# EasyEDA Pro project Blance_Car.epro

# Schematic 平衡小车
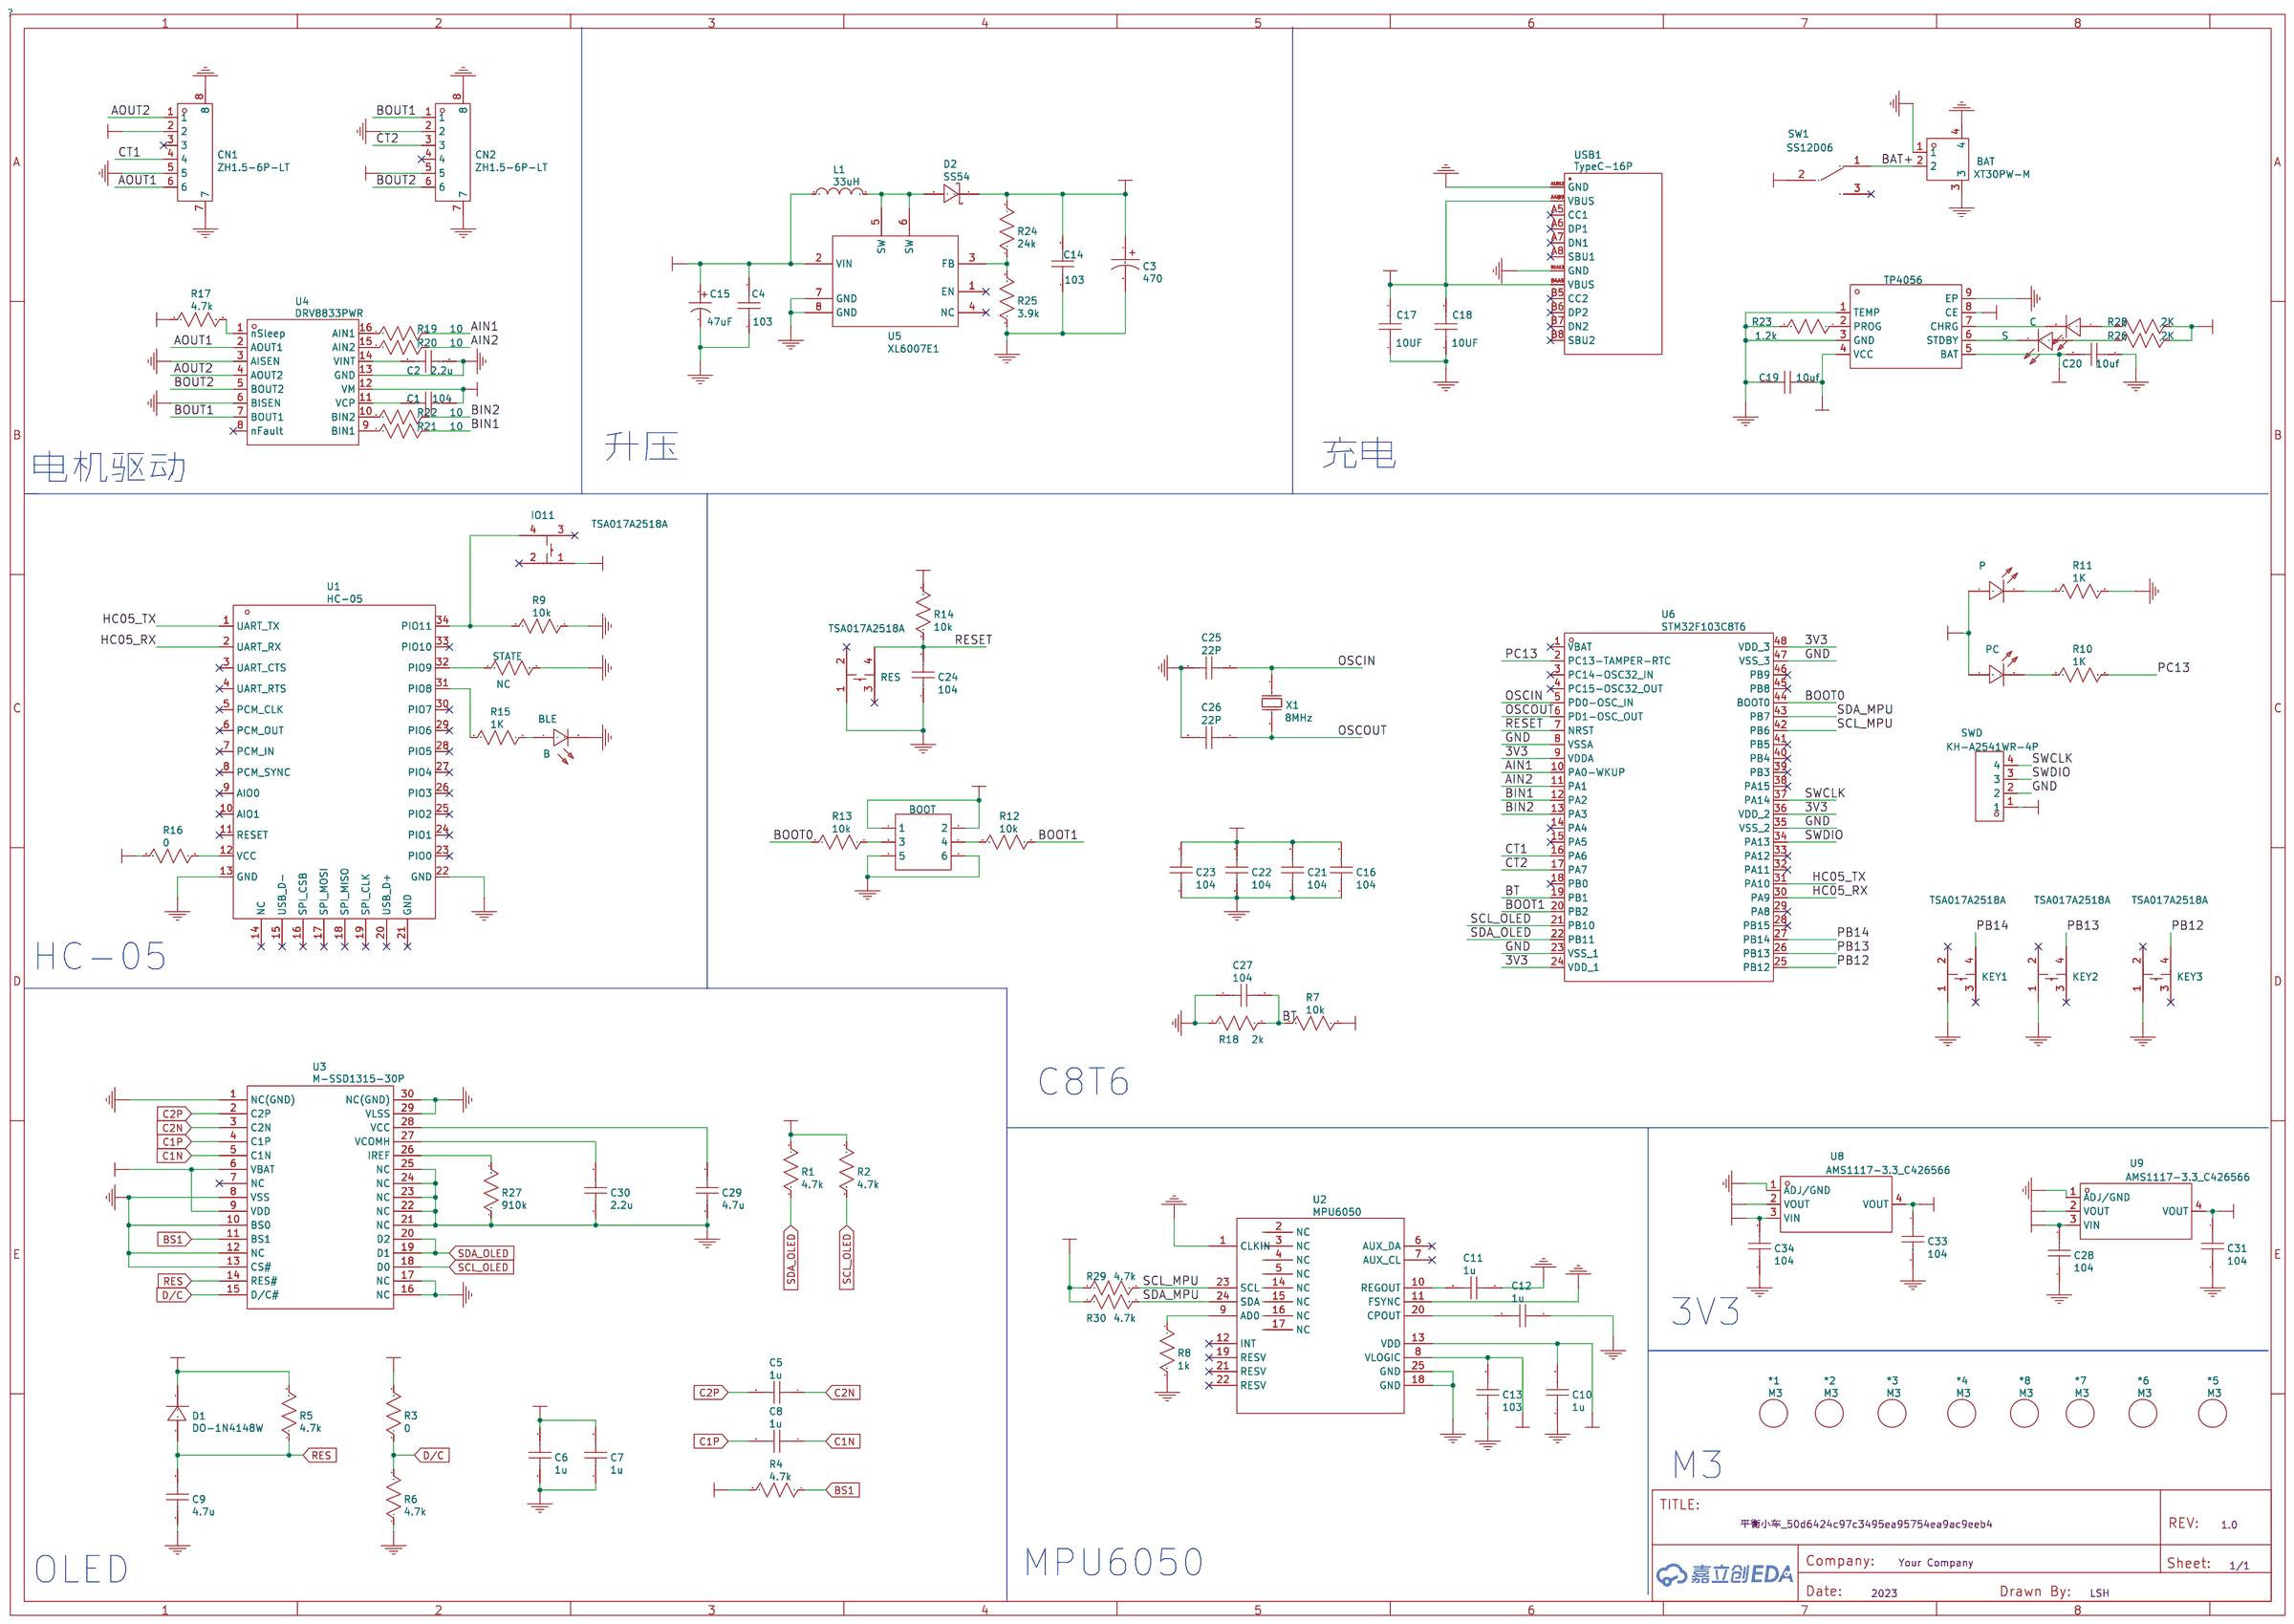
[diagram p0: schematic sheet]

## Parts
*1  M3  [M3 125X200]
*2  M3  [M3 125X200]
*3  M3  [M3 125X200]
*4  M3  [M3 125X200]
*5  M3  [M3 125X200]
*6  M3  [M3 125X200]
*7  M3  [M3 125X200]
*8  M3  [M3 125X200]
BAT  XT30PW-M  [CONN-TH_XT30PW-M]
BLE  B  [LED0603-R-RD]
BOOT  HDR-IDC-2.54-2X3P  [HDR-TH_6P-P2.54-V-M-R2-C3-S2.54-1]
C  204-10SURD/S530-A3  [LED0805-RD]
C1  104  [C0805]
C2  2.2u  [C0805]
C3  470  [CAP-SMD_BD6.3-L6.6-W6.6-FD]
C4  103  [C0805]
C5  1u  [C0603]
C6  1u  [C0603]
C7  1u  [C0603]
C8  1u  [C0603]
C9  4.7u  [C0603]
C10  1u  [C0603]
C11  1u  [C0603]
C12  1u  [C0603]
C13  103  [C0603]
C14  103  [C0805]
C15  47uF  [CAP-SMD_BD6.3-L6.6-W6.6-FD]
C16  104  [C0603]
C17  10UF  [C0805]
C18  10UF  [C0805]
C19  10uf  [C0603]
C20  10uf  [C0805]
C21  104  [C0603]
C22  104  [C0603]
C23  104  [C0603]
C24  104  [C0603]
C25  22P  [C0603]
C26  22P  [C0603]
C27  104  [C0603]
C28  104  [C0805]
C29  4.7u  [C0603]
C30  2.2u  [C0603]
C31  104  [C0805]
C33  104  [C0805]
C34  104  [C0805]
CN1  ZH1.5-6P-LT  [CONN-SMD_ZH1.5-6P-LT]
CN2  ZH1.5-6P-LT  [CONN-SMD_ZH1.5-6P-LT]
D1  DO-1N4148W  [SOD-123FL]
D2  SS54  [SMA_L4.4-W2.8-LS5.4-RD]
IO11  TSA017A2518A  [SW-SMD_4P-L4.2-W3.2-P2.15-LS5.2]
KEY1  TSA017A2518A  [SW-SMD_4P-L4.2-W3.2-P2.15-LS5.2]
KEY2  TSA017A2518A  [SW-SMD_4P-L4.2-W3.2-P2.15-LS5.2]
KEY3  TSA017A2518A  [SW-SMD_4P-L4.2-W3.2-P2.15-LS5.2]
L1  33uH  [IND-SMD_L12.5-W12.5_GSDRK127P]
P  204-10SURD/S530-A3  [LED0805-RD]
PC  204-10SURD/S530-A3  [LED0805-RD]
R1  4.7k  [R0603]
R2  4.7k  [R0603]
R3  0  [R0603]
R4  4.7k  [R0603]
R5  4.7k  [R0603]
R6  4.7k  [R0603]
R7  10k  [R0603]
R8  1k  [R0603]
R9  10k  [R0603]
R10  1K  [R0603]
R11  1K  [R0603]
R12  10k  [R0603]
R13  10k  [R0603]
R14  10k  [R0603]
R15  1K  [R0603]
R16  0  [R0603]
R17  4.7k  [R0603]
R18  2k  [R0603]
R19  10  [R0603]
R20  10  [R0603]
R21  10  [R0603]
R22  10  [R0603]
R23  1.2k  [R0603]
R24  24k  [R0603]
R25  3.9k  [R0603]
R26  2K  [R0603]
R27  910k  [R0603]
R28  2K  [R0603]
R29  4.7k  [R0603]
R30  4.7k  [R0603]
RES  TSA017A2518A  [SW-SMD_4P-L4.2-W3.2-P2.15-LS5.2]
S  204-10SURD/S530-A3  [LED0805-RD]
STATE  NC  [R0603]
SW1  SS12D06  [SW-TH_HOOYA_SS-12D06G4]
SWD  KH-A2541WR-4P  [HDR-TH_4P-P2.54-H-M-W10.4]
U1  HC-05  [BULETM-SMD_HC-05]
U2  MPU6050  [QFN-24_L4.0-W4.0-P0.50-TL-EP2.7]
U3  M-SSD1315-30P  [M-SSD1315-30PIN]
U4  DRV8833PWR  [TSSOP-16_L5.0-W4.4-P0.65-LS6.4-BL]
U5  XL6007E1  [SOIC-8_L5.0-W4.0-P1.27-LS6.0-BL]
U6  STM32F103C8T6  [LQFP-48_L7.0-W7.0-P0.50-LS9.0-BL]
U7  TP4056  [ESOP-8_L4.9-W3.9-P1.27-LS6.0-BL-EP]
U8  AMS1117-3.3_C426566  [SOT-223_L6.5-W3.5-P2.30-LS7.0-BR]
U9  AMS1117-3.3_C426566  [SOT-223_L6.5-W3.5-P2.30-LS7.0-BR]
USB1  TypeC-16P  [USB-SMD_TYPEC-16PIN]
X1  8MHz  [HC-49-SMD_L7.0-W3.0]

## Library data of the parts
*1-*8 = M3: BOM名称: 铜柱孔; 学习资源: www.ooocke.com; 版权归属: 源创客
BAT = XT30PW-M: link: https://cn.bing.com/search?q=datasheet: XT30PW-M; Supplier: LCSC; Supplier Part: C431092; Manufacturer: Changzhou Amass Elec; JLCPCB Part Class: Extended Part
BLE = B: link: https://lcsc.com/product-detail/Light-Emitting-Diodes-LED_Hubei-KENTO-Elec-0603-Green_C12624.html; Supplier: LCSC; Manufacturer: EVERLIGHT; Manufacturer Part: 19-217/BHC-ZL1M2RY/3T; image: //image.lceda.cn/szlcsc/C72041.jpg; Supplier Part: C72041; JLCPCB Part Class: Basic; JLCPCB SMD: Yes
BOOT = HDR-IDC-2.54-2X3P: link: https://lcsc.com/product-detail/Female-Header_Made-in-China-Made-in-China-Made-in-China-Made-in-Cina-2-54mm-2x3-Female-header-Bagged-RoHS_C47552.html; 3DModel: HDR2.54-M-LI-2x3P; Supplier: LCSC; Manufacturer: BOOMELE; Manufacturer Part: 2X3 2.54mm IDC Box; image: //image.lceda.cn/szlcsc/C11214.jpg; Supplier Part: C11214
C P PC S = 204-10SURD/S530-A3: link: https://item.szlcsc.com/255094.html; Supplier: LCSC; Manufacturer: EVERLIGHT; Supplier Part: C99772
C1 C28 C31 C33 C34 = 104: link: https://item.szlcsc.com/373011.html; 3DModel: C0805_L2.0-W1.3-H1.3
C2 = 2.2u: link: https://item.szlcsc.com/373011.html; 3DModel: C0805_L2.0-W1.3-H1.3
C3 = 470: link: https://item.szlcsc.com/265679.html
C4 C14 = 103: link: https://item.szlcsc.com/373011.html; 3DModel: C0805_L2.0-W1.3-H1.3
C5-C8 C10-C12 = 1u: link: https://item.szlcsc.com/362304.html; 3DModel: C0603_L1.6-W0.8-H0.8
C9 C29 = 4.7u: link: https://item.szlcsc.com/362304.html; 3DModel: C0603_L1.6-W0.8-H0.8
C13 = 103: link: https://item.szlcsc.com/362304.html; 3DModel: C0603_L1.6-W0.8-H0.8
C15 = 47uF: link: https://item.szlcsc.com/265679.html; Supplier: LCSC; Manufacturer: ROQANG; Manufacturer Part: RVT1V470M0605; Supplier Part: C72522; JLCPCB Part Class: Extended Part
C16 C21-C24 C27 = 104: link: https://item.szlcsc.com/362304.html; 3DModel: C0603_L1.6-W0.8-H0.8
C17 C18 = 10UF: link: https://item.szlcsc.com/373011.html; 3DModel: C0805_L2.0-W1.3-H1.3
C19 = 10uf: link: https://item.szlcsc.com/362304.html; 3DModel: C0603_L1.6-W0.8-H0.8
C20 = 10uf: link: https://item.szlcsc.com/373011.html; 3DModel: C0805_L2.0-W1.3-H1.3
C25 C26 = 22P: link: https://item.szlcsc.com/362304.html; 3DModel: C0603_L1.6-W0.8-H0.8
C30 = 2.2u: link: https://item.szlcsc.com/362304.html; 3DModel: C0603_L1.6-W0.8-H0.8
CN1 CN2 = ZH1.5-6P-LT: link: https://item.szlcsc.com/767135.html; Supplier: LCSC; Supplier Part: C722928; Manufacturer: CAX; JLCPCB Part Class: Extended Part
D1 = DO-1N4148W: 3DModel: SOD-123FL_L2.8-W1.8-H1.1-LS3.6; Manufacturer: MDD; Manufacturer Part: 1N4148W; Supplier: LCSC; Supplier Part: C84367; 单价: 0.044841; 物料编码: A20006
D2 = SS54: link: https://so.szlcsc.com/global.html?c=&k=C50840; Supplier: LCSC; Supplier Part: C116709; Manufacturer: Jingdao; Manufacturer Part: SS210; JLCPCB Part Class: Extended Part
IO11 KEY1-KEY3 RES = TSA017A2518A: link: https://item.szlcsc.com/617092.html; Supplier: LCSC; Supplier Part: C2888884; Manufacturer: BZCN(博众电气); JLCPCB Part Class: Extended Part
L1 = 33uH: link: https://item.szlcsc.com/153750.html; 3DModel: IND-SMD_L12.5-W12.5-H8.0_GSDRK127P; Supplier: LCSC; Supplier Part: C329385; Manufacturer: Chilisin Elec; Manufacturer Part: MHCI06030-330M-R8; JLCPCB Part Class: Extended Part
R1 R2 R4-R6 R29 R30 = 4.7k: 3DModel: R0603_L1.6-W0.8-H0.8; link: https://www.mouser.in/datasheet/2/447/PYu_RT_1_to_0_01_RoHS_L_11-1669912.pdf
R3 = 0: 3DModel: R0603_L1.6-W0.8-H0.8; link: https://www.mouser.in/datasheet/2/447/PYu_RT_1_to_0_01_RoHS_L_11-1669912.pdf
R7 = 10k: 3DModel: R0603_L1.6-W0.8-H0.8; link: https://www.mouser.in/datasheet/2/447/PYu_RT_1_to_0_01_RoHS_L_11-1669912.pdf
R8 = 1k: 3DModel: R0603_L1.6-W0.8-H0.8; link: https://www.mouser.in/datasheet/2/447/PYu_RT_1_to_0_01_RoHS_L_11-1669912.pdf
R9 R12-R14 = 10k: link: https://item.szlcsc.com/137208.html; 3DModel: R0603_L1.6-W0.8-H0.8
R10 R11 R15 = 1K: link: https://item.szlcsc.com/137208.html; 3DModel: R0603_L1.6-W0.8-H0.8
R16 = 0: link: https://item.szlcsc.com/137208.html; 3DModel: R0603_L1.6-W0.8-H0.8
R17 = 4.7k: link: https://item.szlcsc.com/137208.html; 3DModel: R0603_L1.6-W0.8-H0.8
R18 = 2k: 3DModel: R0603_L1.6-W0.8-H0.8; link: https://www.mouser.in/datasheet/2/447/PYu_RT_1_to_0_01_RoHS_L_11-1669912.pdf
R19-R22 = 10: link: https://item.szlcsc.com/137208.html; 3DModel: R0603_L1.6-W0.8-H0.8
R23 = 1.2k: 3DModel: R0603_L1.6-W0.8-H0.8; link: https://www.mouser.in/datasheet/2/447/PYu_RT_1_to_0_01_RoHS_L_11-1669912.pdf
R24 = 24k: 3DModel: R0603_L1.6-W0.8-H0.8; link: https://www.mouser.in/datasheet/2/447/PYu_RT_1_to_0_01_RoHS_L_11-1669912.pdf
R25 = 3.9k: 3DModel: R0603_L1.6-W0.8-H0.8; link: https://www.mouser.in/datasheet/2/447/PYu_RT_1_to_0_01_RoHS_L_11-1669912.pdf
R26 R28 = 2K: 3DModel: R0603_L1.6-W0.8-H0.8; link: https://www.mouser.in/datasheet/2/447/PYu_RT_1_to_0_01_RoHS_L_11-1669912.pdf
R27 = 910k: 3DModel: R0603_L1.6-W0.8-H0.8; link: https://www.mouser.in/datasheet/2/447/PYu_RT_1_to_0_01_RoHS_L_11-1669912.pdf
STATE = NC: link: https://item.szlcsc.com/137208.html; 3DModel: R0603_L1.6-W0.8-H0.8
SW1 = SS12D06: link: https://atta.szlcsc.com/upload/public/pdf/source/20220518/C4D36190FA72FACD82E80E12C2EEB692.pdf
SWD = KH-A2541WR-4P: link: https://item.szlcsc.com/502968.html; 3DModel: HDR-TH_4P-P2.54-M-WI-1X4P; Supplier: LCSC; Supplier Part: C2833320; Manufacturer: kinghelm(金航标); JLCPCB Part Class: Extended Part
U1 = HC-05
U2 = MPU6050: link: https://item.szlcsc.com/245167.html; 3DModel: QFN-24_L4.0-W4.0-H0.9-P0.50-; Manufacturer Part: ?
U3 = M-SSD1315-30P: 3DModel: OLED-0.96-SSD1306; Manufacturer: 中景园; Manufacturer Part: 0.96‘OLED-SS1315; Supplier: 淘宝; 单价: 8.5; 物料编码: A90004
U4 = DRV8833PWR: 3DModel: TSSOP-16_L5.0-W4.4-H1.0-LS6.4-P0.65; Supplier: LCSC; Supplier Part: C544801; Manufacturer: TI(德州仪器)
U5 = XL6007E1: link: https://item.szlcsc.com/417287.html; 3DModel: SOIC-8_L4.9-W3.9-H1.7-LS6.0-P1.27; Supplier: LCSC; Manufacturer: XLSEMI; Supplier Part: C73334; JLCPCB Part Class: Extended Part
U6 = STM32F103C8T6: link: https://atta.szlcsc.com/upload/public/pdf/source/20190808/C411336_D1D2DF7683029D856BA010BA7A5BF7EA.pdf; Supplier Part: C8734; Supplier: LCSC; 3DModel: LQFP-48_L7.0-W7.0-H1.4-LS9.0-P0.50; Manufacturer: STMicroelectronics; image: //image.lceda.cn/szlcsc/C8734.jpg; JLCPCB Part Class: Basic
U7 = TP4056: link: https://www.mornsun.cn/html/pdf/SCM1501B.html; 3DModel: ESOP-8_L4.9-W3.9-H1.6-LS6.0-P1.27; Supplier: LCSC; Supplier Part: C725790; Manufacturer: UMW(Youtai Semiconductor Co., Ltd.); JLCPCB Part Class: Extended Part
U8 U9 = AMS1117-3.3_C426566: link: https://item.szlcsc.com/109711.html; 3DModel: SOT-223-4P_L6.5-W3.5-H1.6-LS7.0-P2.30; Supplier: LCSC; Supplier Part: C426566; Manufacturer: SLKORMICRO Elec.; Manufacturer Part: AMS1117-3.3; JLCPCB Part Class: Extended Part
USB1 = TypeC-16P
X1 = 8MHz: link: https://item.szlcsc.com/404923.html; 3DModel: HC-49-SMD_L7.0-W4.0-H2.3-LS7.8; Supplier: LCSC; Manufacturer: YXC; Manufacturer Part: X49SD304MSD2SC; Supplier Part: C52061

## Nets
3V3: BOOT.1 BOOT.2 C6.2 C7.2 C10.2 C13.2 C16.2 C21.2 C22.2 C23.2 C31.1 C33.1 CN1.2 CN2.5 D1.2(K) IO11.1 P.1(A) PC.1(A) R1.1 R2.1 R3.2 R4.2 R5.2 R14.2 R16.2 R17.2 R29.1 R30.1 SWD.1 U2.8(VLOGIC) U2.13(VDD) U3.6(VBAT) U3.9(VDD) U6.9(VDDA) U6.24(VDD_1) U6.36(VDD_2) U6.48(VDD_3) U8.2(VOUT) U8.4(VOUT) U9.2(VOUT) U9.4(VOUT)
9V: C1.2 C3.1 C14.2 D2.1(K) R24.2 U4.12(VM)
GND: BAT.1 BAT.3 BAT.4 BLE.2(C) BOOT.5 BOOT.6 C2.2 C3.2 C4.1 C6.1 C7.1 C9.1 C10.1 C11.1 C12.1 C13.1 C14.1 C15.2 C16.1 C17.1 C18.1 C19.1 C20.2 C21.1 C22.1 C23.1 C24.1 C25.2 C26.2 C27.1 C28.1 C29.1 C30.1 C31.2 C33.2 C34.1 CN1.5 CN1.7 CN1.8 CN2.2 CN2.7 CN2.8 KEY1.1 KEY2.1 KEY3.1 R6.1 R8.2 R9.1 R11.2 R18.1 R23.2 R25.1 R27.1 RES.1 STATE.1 SWD.2 U1.13(GND) U1.22(GND) U2.1(CLKIN) U2.11(FSYNC) U2.18(GND) U2.25(GND) U3.1(NC(GND)) U3.8(VSS) U3.10(BS0) U3.12(NC) U3.13(CS#) U3.16(NC) U3.17(NC) U3.21(NC) U3.22(NC) U3.23(NC) U3.24(NC) U3.25(NC) U3.29(VLSS) U3.30(NC(GND)) U4.3(AISEN) U4.6(BISEN) U4.13(GND) U5.7(GND) U5.8(GND) U6.8(VSSA) U6.23(VSS_1) U6.35(VSS_2) U6.47(VSS_3) U7.1(TEMP) U7.3(GND) U7.9(EP) U8.1(ADJ/GND) U9.1(ADJ/GND) USB1.A1B12(GND) USB1.B1A12(GND)
AIN1: R19.1 U6.10(PA0-WKUP)
AIN2: R20.1 U6.11(PA1)
AOUT1: CN1.6 U4.2(AOUT1)
AOUT2: CN1.1 U4.4(AOUT2)
BAT+: BAT.2 C20.1 SW1.1 U7.5(BAT)
BIN1: R21.1 U6.12(PA2)
BIN2: R22.1 U6.13(PA3)
BOOT0: R13.2 U6.44(BOOT0)
BOOT1: R12.1 U6.20(PB2)
BOUT1: CN2.1 U4.7(BOUT1)
BOUT2: CN2.6 U4.5(BOUT2)
BS1: R4.1 U3.11(BS1)
BT: C27.2 R7.1 R18.2 U6.19(PB1)
C1N: C8.1 U3.5(C1N)
C1P: C8.2 U3.4(C1P)
C2N: C5.1 U3.3(C2N)
C2P: C5.2 U3.2(C2P)
CT1: CN1.4 U6.16(PA6)
CT2: CN2.3 U6.17(PA7)
D/C: R3.1 R6.2 U3.15(D/C#)
HC05_RX: U1.2(UART_RX) U6.30(PA9)
HC05_TX: U1.1(UART_TX) U6.31(PA10)
IN+: C17.2 C18.2 C19.2 R26.1 R28.1 U7.4(VCC) U7.8(CE) USB1.A4B9(VBUS) USB1.B4A9(VBUS)
NC: U2.2(NC) U2.3(NC) U2.4(NC) U2.5(NC) U2.14(NC) U2.15(NC) U2.16(NC) U2.17(NC)
OSCIN: C25.1 U6.5(PD0-OSC_IN) X1.1(OSC1)
OSCOUT: C26.1 U6.6(PD1-OSC_OUT) X1.2(OSC2)
PB12: KEY3.4 U6.25(PB12)
PB13: KEY2.4 U6.26(PB13)
PB14: KEY1.4 U6.27(PB14)
PC13: R10.2 U6.2(PC13-TAMPER-RTC)
POWER: C4.2 C15.1 C28.2 C34.2 L1.1 R7.2 SW1.2 U5.2(VIN) U8.3(VIN) U9.3(VIN)
RES: C9.2 D1.1(A) R5.1 U3.14(RES#)
RESET: C24.2 R14.1 RES.4 U6.7(NRST)
SCL_MPU: R29.2 U2.23(SCL) U6.42(PB6)
SCL_OLED: R2.2 U3.18(D0) U6.21(PB10)
SDA_MPU: R30.2 U2.24(SDA) U6.43(PB7)
SDA_OLED: R1.2 U3.19(D1) U3.20(D2) U6.22(PB11)
SWCLK: SWD.4 U6.37(PA14)
SWDIO: SWD.3 U6.34(PA13)
BLE_1: BLE.1(A) R15.1
R10_1: PC.2(K) R10.1
R11_1: P.2(K) R11.1
R12_2: BOOT.4 R12.2
R13_1: BOOT.3 R13.1
R23_1: R23.1 U7.2(PROG)
R26_2: R26.2 S.1(A)
R28_2: C.1(A) R28.2
U1_12: R16.1 U1.12(VCC)
U1_31: R15.2 U1.31(PIO8)
U1_32: STATE.2 U1.32(PIO9)
U1_34: IO11.4 R9.2 U1.34(PIO11)
U2_9: R8.1 U2.9(AD0)
U2_10: C11.2 U2.10(REGOUT)
U2_20: C12.2 U2.20(CPOUT)
U3_26: R27.2 U3.26(IREF)
U3_27: C30.2 U3.27(VCOMH)
U3_28: C29.2 U3.28(VCC)
U4_1: R17.1 U4.1(nSleep)
U4_9: R21.2 U4.9(BIN1)
U4_10: R22.2 U4.10(BIN2)
U4_11: C1.1 U4.11(VCP)
U4_14: C2.1 U4.14(VINT)
U4_15: R20.2 U4.15(AIN2)
U4_16: R19.2 U4.16(AIN1)
U5_3: R24.1 R25.2 U5.3(FB)
U5_5: D2.2(A) L1.2 U5.5(SW) U5.6(SW)
U7_6: S.2(K) U7.6(STDBY)
U7_7: C.2(K) U7.7(CHRG)

Not connected (* = marked no-connect by the designer): CN1 3*; CN2 4*; IO11 2* 3*; KEY1 2* 3*; KEY2 2* 3*; KEY3 2* 3*; RES 2* 3*; SW1 3*; U1 3(UART_CTS)* 4(UART_RTS)* 5(PCM_CLK)* 6(PCM_OUT)* 7(PCM_IN)* 8(PCM_SYNC)* 9(AIO0)* 10(AIO1)* 11(RESET)* 14(NC)* 15(USB_D-)* 16(SPI_CSB)* 17(SPI_MOSI)* 18(SPI_MISO)* 19(SPI_CLK)* 20(USB_D+)* 21(GND)* 23(PIO0)* 24(PIO1)* 25(PIO2)* 26(PIO3)* 27(PIO4)* 28(PIO5)* 29(PIO6)* 30(PIO7)* 33(PIO10)*; U2 6(AUX_DA)* 7(AUX_CL)* 12(INT)* 19(RESV)* 21(RESV)* 22(RESV)*; U3 7(NC)*; U4 8(nFault)*; U5 1(EN)* 4(NC)*; U6 1(VBAT)* 3(PC14-OSC32_IN)* 4(PC15-OSC32_OUT)* 14(PA4)* 15(PA5)* 18(PB0)* 28(PB15)* 29(PA8)* 32(PA11)* 33(PA12)* 38(PA15)* 39(PB3)* 40(PB4)* 41(PB5)* 45(PB8)* 46(PB9)*; USB1 A5(CC1)* A6(DP1)* A7(DN1)* A8(SBU1)* B5(CC2)* B6(DP2)* B7(DN2)* B8(SBU2)*

## Notes on the sheet
- 升压
- 充电
- 电机驱动
- HC-05
- C8T6
- 3V3
- M3
- MPU6050
- OLED

# Board 1-PCB_平衡小车
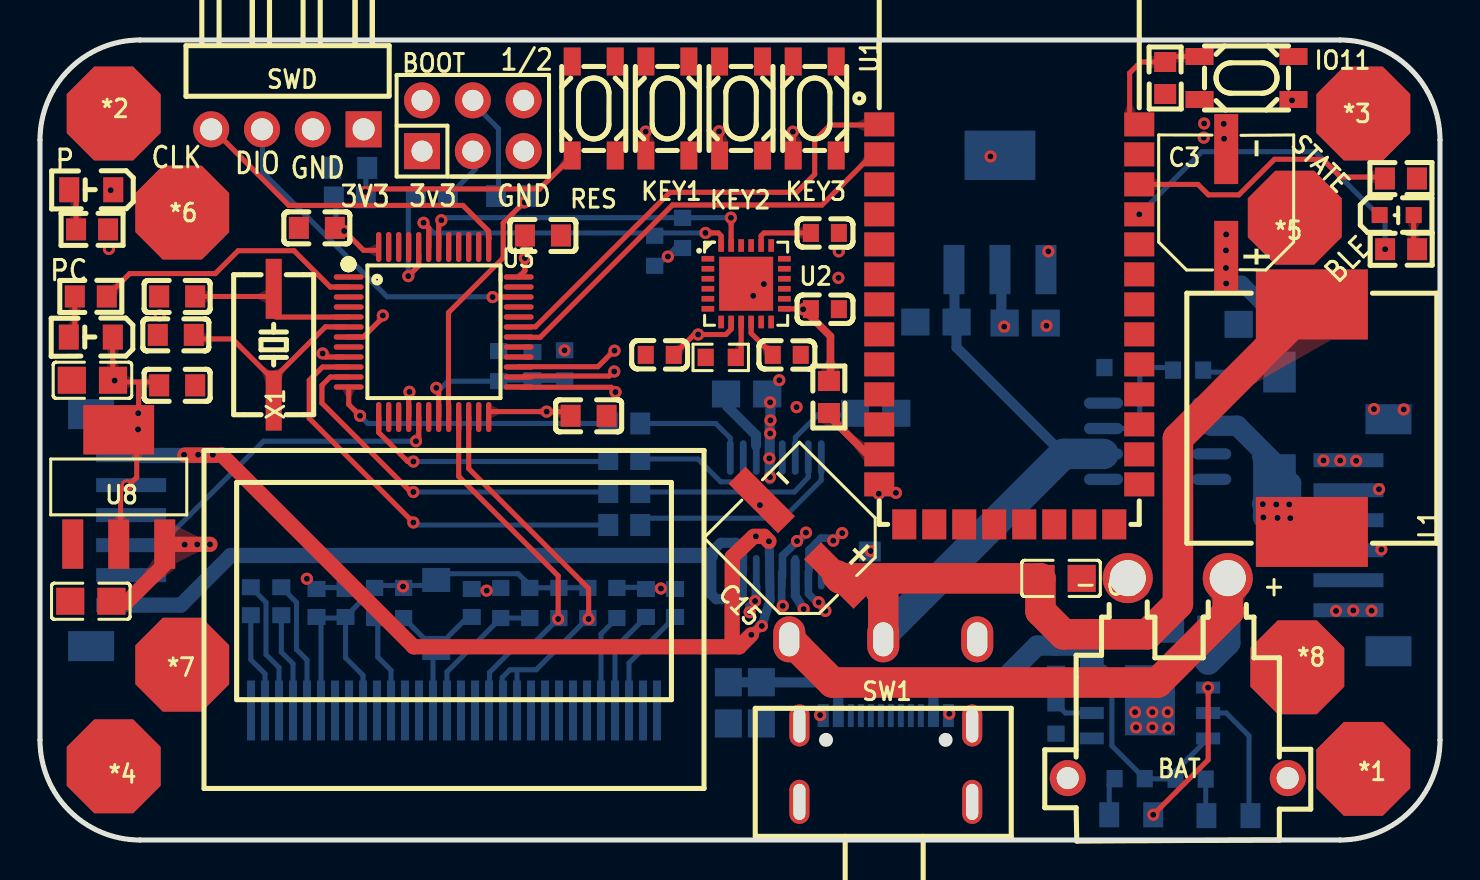
[diagram p1: board, top side]
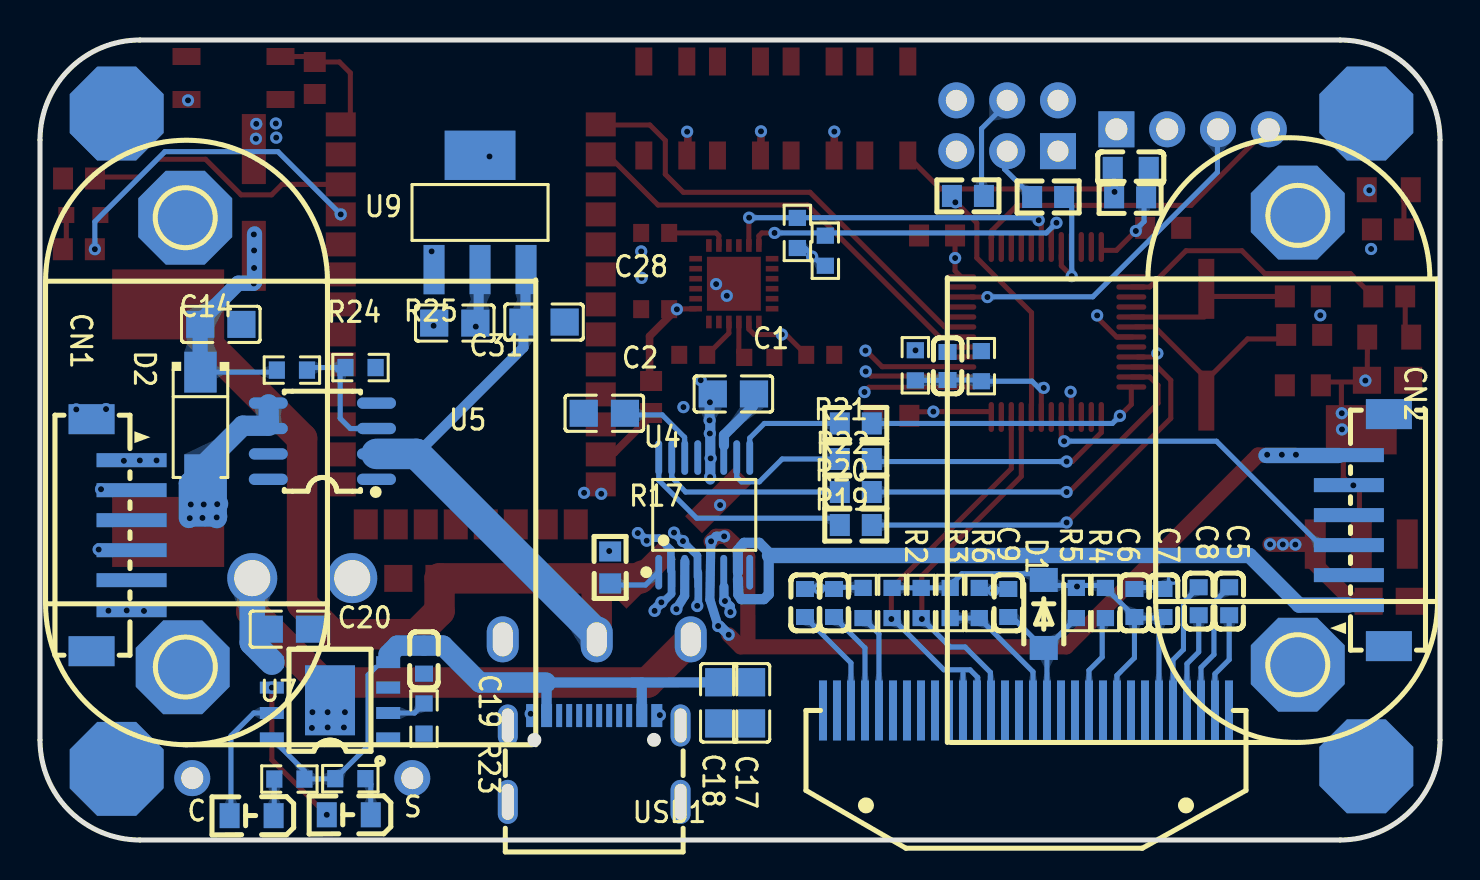
[diagram p2: board, bottom side, seen from below]

Outline 70 x 40 mm; copper layers: Top Layer, Inner1, Inner2, Bottom Layer. Coordinates in mm from the lower left corner of the outline.
Outline path: 0,35 arc(1.46,38.54) 5,40 65,40 arc(68.54,38.54) 70,35 70,5 arc(68.54,1.46) 65,0 5,0 arc(1.46,1.46) 0,5 0,35
Stack: Top Layer 0.035mm / Dielectric1 0.48mm PP er 4.5 / Inner1 0.035mm / Dielectric2 0.48mm FR4 er 4.5 / Inner2 0.035mm / Dielectric3 0.48mm PP er 4.5 / Bottom Layer 0.035mm

## Design rules (mm)
spacing Default (default): track to track 0.152, other pairs 0 to 0.152
track width Default (default): min 0.254, default 0.254, max 25.4
differential pair differentialPair (default): width min 0.127, default 0.254, max 2.54; gap min 0.152, default 0.152
via Default (default): diameter min 0.61, default 0.61, max 100.025; hole min 0.305, default 0.305, max 59.995
net GND uses gge67329
net 3V3 uses gge67296
pour e29 uses gge67302
pour e62 uses gge67296
pour e364 uses gge67308
pour e766 uses gge67329

## Placement (name value [footprint] x y rotation side)
*1  M3  [M3 125X200]  66.17 3.56 0 top
*2  M3  [M3 125X200]  3.68 36.32 0 top
*3  M3  [M3 125X200]  66.17 36.32 0 top
*4  M3  [M3 125X200]  3.68 3.68 0 top
*5  M3  [M3 125X200]  62.74 31.11 0 top
*6  M3  [M3 125X200]  7.11 31.37 0 top
*7  M3  [M3 125X200]  7.11 8.76 0 top
*8  M3  [M3 125X200]  62.87 8.64 0 top
BAT  XT30PW-M  [CONN-TH_XT30PW-M]  56.89 8.09 0 top
BLE  B  [LED0603-R-RD]  67.83 31.25 0 top
BOOT  HDR-IDC-2.54-2X3P  [HDR-TH_6P-P2.54-V-M-R2-C3-S2.54-1]  21.64 35.71 0 top
C  204-10SURD/S530-A3  [LED0805-RD]  59.42 1.22 0 bottom
C1  104  [C0805]  35.33 22.3 0 bottom
C2  2.2u  [C0805]  41.78 21.34 0 bottom
C3  470  [CAP-SMD_BD6.3-L6.6-W6.6-FD]  59.31 31.88 90 top
C4  103  [C0805]  51.05 13.08 180 top
C5  1u  [C0603#2]  10.54 11.94 270 bottom
C6  1u  [C0603#2]  15.28 11.85 270 bottom
C7  1u  [C0603#2]  13.83 11.85 270 bottom
C8  1u  [C0603#2]  12.06 11.94 270 bottom
C9  4.7u  [C0603#2]  21.59 11.85 270 bottom
C10  1u  [C0603#2]  39.24 26.54 180 top
C11  1u  [C0603#2]  37.34 24.26 180 top
C12  1u  [C0603#2]  39.24 30.35 180 top
C13  103  [C0603#2]  30.99 24.26 0 top
C14  103  [C0805]  60.96 25.78 0 bottom
C15  47uF  [CAP-SMD_BD6.3-L6.6-W6.6-FD]  37.97 15.11 135 top
C16  104  [C0603]  27.43 21.21 180 top
C17  10UF  [C0805]  34.42 6.86 90 bottom
C18  10UF  [C0805]  36.07 6.86 90 bottom
C19  10uf  [C0603#2]  50.8 9.02 90 bottom
C20  10uf  [C0805]  57.53 10.54 180 bottom
C21  104  [C0603]  13.84 30.61 0 top
C22  104  [C0603]  25.15 30.23 180 top
C23  104  [C0603]  6.86 22.73 180 top
C24  104  [C0603]  15.46 33.61 0 bottom
C25  22P  [C0603]  6.86 27.18 180 top
C26  22P  [C0603]  6.79 25.26 180 top
C27  104  [C0603#2]  24.62 23.7 270 bottom
C28  104  [C0805]  44.8 25.9 0 bottom
C29  4.7u  [C0603#2]  31.75 11.85 270 bottom
C30  2.2u  [C0603#2]  30.3 11.85 270 bottom
C31  104  [C0805]  49.26 25.85 0 bottom
C33  104  [C0805]  2.62 22.99 180 top
C34  104  [C0805]  2.54 11.94 0 top
CN1  ZH1.5-6P-LT  [CONN-SMD_ZH1.5-6P-LT]  66.42 15.24 270 bottom
CN2  ZH1.5-6P-LT  [CONN-SMD_ZH1.5-6P-LT]  3.56 15.49 90 bottom
D1  DO-1N4148W  [SOD-123FL]  19.81 11.3 270 bottom
D2  SS54  [SMA_L4.4-W2.8-LS5.4-RD]  61.98 20.83 270 bottom
IO11  TSA017A2518A  [SW-SMD_4P-L4.2-W3.2-P2.15-LS5.2]  60.32 38.1 270 top
KEY1  TSA017A2518A  [SW-SMD_4P-L4.2-W3.2-P2.15-LS5.2]  31.37 36.58 0 top
KEY2  TSA017A2518A  [SW-SMD_4P-L4.2-W3.2-P2.15-LS5.2]  35.05 36.58 0 top
KEY3  TSA017A2518A  [SW-SMD_4P-L4.2-W3.2-P2.15-LS5.2]  38.74 36.58 0 top
L1  33uH  [IND-SMD_L12.5-W12.5_GSDRK127P]  63.59 21.09 270 top
P  204-10SURD/S530-A3  [LED0805-RD]  2.56 32.51 180 top
PC  204-10SURD/S530-A3  [LED0805-RD]  2.54 25.15 180 top
R1  4.7k  [R0603#2]  27.39 11.85 270 bottom
R2  4.7k  [R0603#2]  25.94 11.85 270 bottom
R3  0  [R0603#2]  24.49 11.85 90 bottom
R4  4.7k  [R0603#2]  16.73 11.85 90 bottom
R5  4.7k  [R0603#2]  18.18 11.85 90 bottom
R6  4.7k  [R0603#2]  23.04 11.85 270 bottom
R7  10k  [R0603#2]  26.23 23.73 90 bottom
R8  1k  [R0603#2]  34.04 24.13 180 top
R9  10k  [R0603]  56.26 38.1 90 top
R10  1K  [R0603]  2.54 27.18 0 top
R11  1K  [R0603]  2.6 30.53 0 top
R12  10k  [R0603]  23.6 32.2 180 bottom
R13  10k  [R0603]  19.59 32.15 180 bottom
R14  10k  [R0603]  15.49 32.13 180 bottom
R15  1K  [R0603]  68.06 29.54 180 top
R16  0  [R0603]  39.45 22.15 90 top
R17  4.7k  [R0603]  41.49 13.63 90 bottom
R18  2k  [R0603#2]  22.94 23.69 270 bottom
R19  10  [R0603]  29.21 15.75 0 bottom
R20  10  [R0603]  29.21 17.4 0 bottom
R21  10  [R0603]  29.21 20.83 0 bottom
R22  10  [R0603]  29.21 19.05 0 bottom
R23  1.2k  [R0603#2]  50.8 6.07 270 bottom
R24  24k  [R0603#2]  57.4 23.5 0 bottom
R25  3.9k  [R0603#2]  53.97 23.62 0 bottom
R26  2K  [R0603#2]  54.48 3.07 180 bottom
R27  910k  [R0603#2]  28.85 11.85 270 bottom
R28  2K  [R0603#2]  57.53 3.05 0 bottom
R29  4.7k  [R0603#2]  32.13 30.35 90 bottom
R30  4.7k  [R0603#2]  30.73 29.46 90 bottom
RES  TSA017A2518A  [SW-SMD_4P-L4.2-W3.2-P2.15-LS5.2]  27.69 36.58 0 top
S  204-10SURD/S530-A3  [LED0805-RD]  54.56 1.26 0 bottom
STATE  NC  [R0603]  68.05 33.07 180 top
SW1  SS12D06  [SW-TH_HOOYA_SS-12D06G4]  42.16 10.03 0 top
SWD  KH-A2541WR-4P  [HDR-TH_4P-P2.54-H-M-W10.4]  12.37 35.53 180 top
U1  HC-05  [BULETM-SMD_HC-05]  48.46 25.78 0 top
U2  MPU6050  [QFN-24_L4.0-W4.0-P0.50-TL-EP2.7]  35.31 27.81 0 top
U3  M-SSD1315-30P  [M-SSD1315-30PIN]  20.7 6.48 0 top
U4  DRV8833PWR  [TSSOP-16_L5.0-W4.4-P0.65-LS6.4-BL]  36.79 16.26 180 bottom
U5  XL6007E1  [SOIC-8_L5.0-W4.0-P1.27-LS6.0-BL]  55.88 19.94 90 bottom
U6  STM32F103C8T6  [LQFP-48_L7.0-W7.0-P0.50-LS9.0-BL]  19.69 25.4 270 top
U7  TP4056  [ESOP-8_L4.9-W3.9-P1.27-LS6.0-BL-EP]  55.5 6.98 90 bottom
U8  AMS1117-3.3_C426566  [SOT-223_L6.5-W3.5-P2.30-LS7.0-BR]  3.94 17.65 270 top
U9  AMS1117-3.3_C426566  [SOT-223_L6.5-W3.5-P2.30-LS7.0-BR]  48 31.38 270 bottom
USB1  TypeC-16P  [USB-SMD_TYPEC-16PIN]  42.29 4.06 180 bottom
X1  8MHz  [HC-49-SMD_L7.0-W3.0]  11.68 24.77 270 top

## Footprints (pads in the part's own frame, mm; a bottom-side part is the same pattern mirrored in y, then rotated)
BULETM-SMD_HC-05
  rect 1.5x1.2 smd: 1(-6.5,10) 2(-6.5,8.5) 3(-6.5,7) 4(-6.5,5.5) 5(-6.5,4) 6(-6.5,2.5) 7(-6.5,1) 8(-6.5,-0.5) 9(-6.5,-2) 10(-6.5,-3.5) 11(-6.5,-5) 12(-6.5,-6.5) 13(-6.5,-8) 22(6.5,-8) 23(6.5,-6.5) 24(6.5,-5) 25(6.5,-3.5) 26(6.5,-2) 27(6.5,-0.5) 28(6.5,1) 29(6.5,2.5) 30(6.5,4) 31(6.5,5.5) 32(6.5,7) 33(6.5,8.5) 34(6.5,10)
  rect 1.2x1.5 smd: 14(-5.25,-10) 15(-3.75,-10) 16(-2.25,-10) 17(-0.75,-10) 18(0.75,-10) 19(2.25,-10) 20(3.75,-10) 21(5.25,-10)
C0603
  rect 1x1.1 smd: 1(-0.9,0) 2(0.9,0)
C0603#2
  rect 0.8x0.9 smd: 1(-0.7,0) 2(0.7,0)
C0805
  rect 1.41x1.35 smd: 1(-1.03,0) 2(1.03,0)
CAP-SMD_BD6.3-L6.6-W6.6-FD
  rect 3.5x1.2 smd: 1(-2.67,0) 2(2.67,0)
CONN-SMD_ZH1.5-6P-LT
  rect 0.7x3.5 smd: 1(-3.75,1) 2(-2.25,1) 3(-0.75,1) 4(0.75,1) 5(2.249,1) 6(3.75,1)
  rect 1.5x2.3 smd: 7(5.8,-1) 8(-5.8,-1)
CONN-TH_XT30PW-M
  round 2.5 hole 1.8: 1(-2.5,5) 2(2.5,5)
  round 1.8 hole 1.1: 3(5.5,-5) 4(-5.5,-5)
ESOP-8_L4.9-W3.9-P1.27-LS6.0-BL-EP
  rect 0.6x1.2 smd: 1(-1.905,-2.909) 2(-0.635,-2.909) 3(0.635,-2.909) 4(1.905,-2.909) 5(1.905,2.909) 6(0.635,2.909) 7(-0.635,2.909) 8(-1.905,2.909)
  rect 3.5x2.5 smd: 9(0,0)
HC-49-SMD_L7.0-W3.0
  rect 3x0.8 smd: 1(-2.794,0) 2(2.794,0)
HDR-TH_4P-P2.54-H-M-W10.4
  rect 1.8x1.8 hole 1.1: 1(-3.81,0)
  round 1.8 hole 1.1: 2(-1.27,0) 3(1.27,0) 4(3.81,0)
HDR-TH_6P-P2.54-V-M-R2-C3-S2.54-1
  rect 1.8x1.8 hole 1.05: 1(-2.54,-1.27)
  round 1.8 hole 1.05: 2(-2.54,1.27) 3(0,-1.27) 4(0,1.27) 5(2.54,-1.27) 6(2.54,1.27)
IND-SMD_L12.5-W12.5_GSDRK127P
  rect 3.5x5.6 smd: 1(-5.687,0) 2(5.688,0)
LED0603-R-RD
  rect 0.8x0.8 smd: 1(0.851,0) 2(-0.851,0)
LED0805-RD
  rect 1x1.25 smd: 1(-1.1,0) 2(1.1,0)
LQFP-48_L7.0-W7.0-P0.50-LS9.0-BL
  oval 0.27x1.5 smd: 1(-2.75,-4.25) 2(-2.25,-4.25) 3(-1.75,-4.25) 4(-1.25,-4.25) 5(-0.75,-4.25) 6(-0.25,-4.25) 7(0.25,-4.25) 8(0.75,-4.25) 9(1.25,-4.25) 10(1.75,-4.25) 11(2.25,-4.25) 12(2.75,-4.25) 25(2.75,4.25) 26(2.25,4.25) 27(1.75,4.25) 28(1.25,4.25) 29(0.75,4.25) 30(0.25,4.25) 31(-0.25,4.25) 32(-0.75,4.25) 33(-1.25,4.25) 34(-1.75,4.25) 35(-2.25,4.25) 36(-2.75,4.25)
  oval 1.5x0.27 smd: 13(4.25,-2.75) 14(4.25,-2.25) 15(4.25,-1.75) 16(4.25,-1.25) 17(4.25,-0.75) 18(4.25,-0.25) 19(4.25,0.25) 20(4.25,0.75) 21(4.25,1.25) 22(4.25,1.75) 23(4.25,2.25) 24(4.25,2.75) 37(-4.25,2.75) 38(-4.25,2.25) 39(-4.25,1.75) 40(-4.25,1.25) 41(-4.25,0.75) 42(-4.25,0.25) 43(-4.25,-0.25) 44(-4.25,-0.75) 45(-4.25,-1.25) 46(-4.25,-1.75) 47(-4.25,-2.25) 48(-4.25,-2.75)
M3 125X200
  custom 4.693x4.693 hole 3.18x3.175: 0(0,0)
M-SSD1315-30PIN
  rect 0.4x3 smd far side: 1(-10.15,0) 2(-9.45,0) 3(-8.751,0) 4(-8.05,0) 5(-7.351,0) 6(-6.651,0) 7(-5.95,0) 8(-5.25,0) 9(-4.55,0) 10(-3.85,0) 11(-3.15,0) 12(-2.45,0) 13(-1.75,0) 14(-1.05,0) 15(-0.35,0) 16(0.349,0) 17(1.05,0) 18(1.75,0) 19(2.45,0) 20(3.15,0) 21(3.85,0) 22(4.55,0) 23(5.25,0) 24(5.949,0) 25(6.649,0) 26(7.349,0) 27(8.05,0) 28(8.749,0) 29(9.45,0) 30(10.15,0)
QFN-24_L4.0-W4.0-P0.50-TL-EP2.7
  rect 0.633x0.28 smd: 1(-1.911,1.25) 2(-1.911,0.75) 3(-1.911,0.25) 4(-1.911,-0.25) 5(-1.911,-0.75) 6(-1.911,-1.25) 13(1.911,-1.25) 14(1.911,-0.75) 15(1.911,-0.25) 16(1.911,0.25) 17(1.911,0.75) 18(1.911,1.25)
  rect 0.28x0.633 smd: 7(-1.25,-1.911) 8(-0.75,-1.911) 9(-0.25,-1.911) 10(0.25,-1.911) 11(0.75,-1.911) 12(1.25,-1.911) 19(1.25,1.911) 20(0.75,1.911) 21(0.25,1.911) 22(-0.25,1.911) 23(-0.75,1.911) 24(-1.25,1.911)
  rect 2.7x2.7 smd: 25(0,0)
R0603
  rect 1x1.1 smd: 1(-0.8,0) 2(0.8,0)
R0603#2
  rect 0.806x0.864 smd: 1(-0.753,0) 2(0.753,0)
SMA_L4.4-W2.8-LS5.4-RD
  rect 2.046x1.62 smd: 1(-2.566,0) 2(2.566,0)
SOD-123FL
  rect 1.2x1.4 smd: 1(1.7,0) 2(-1.7,0)
SOIC-8_L5.0-W4.0-P1.27-LS6.0-BL
  oval 0.569x1.95 smd: 1(-1.905,-2.705) 2(-0.635,-2.705) 3(0.635,-2.705) 4(1.905,-2.705) 5(1.905,2.705) 6(0.635,2.705) 7(-0.635,2.705) 8(-1.905,2.705)
SOT-223_L6.5-W3.5-P2.30-LS7.0-BR
  rect 2.465x1.05 smd: 1(2.857,-2.3) 2(2.857,0) 3(2.857,2.3)
  rect 2.465x3.54 smd: 4(-2.857,0)
SW-SMD_4P-L4.2-W3.2-P2.15-LS5.2
  rect 0.85x1.4 smd: 1(1.075,2.35) 2(1.075,-2.35) 3(-1.075,2.35) 4(-1.075,-2.35)
SW-TH_HOOYA_SS-12D06G4
  oval 1.6x2.3 hole 1x1.7: 1(-4.7,0) 2(0,0) 3(4.7,0)
TSSOP-16_L5.0-W4.4-P0.65-LS6.4-BL
  oval 0.343x1.732 smd: 1(-2.275,-2.866) 2(-1.625,-2.866) 3(-0.975,-2.866) 4(-0.325,-2.866) 5(0.325,-2.866) 6(0.975,-2.866) 7(1.625,-2.866) 8(2.275,-2.866) 9(2.275,2.865) 10(1.625,2.865) 11(0.975,2.865) 12(0.325,2.865) 13(-0.325,2.865) 14(-0.975,2.865) 15(-1.625,2.865) 16(-2.275,2.865)
USB-SMD_TYPEC-16PIN
  oval 1x2.1 hole 0.6x1.7: 12(-4.32,1.663) 13(4.32,1.663)
  oval 1x2.2 hole 0.6x1.8: 14(-4.32,-2.158) 15(4.32,-2.158)
  rect 0.55x1.15 smd: A1B12(-3.13,2.158) A4B9(-2.38,2.158) B1A12(3.131,2.158) B4A9(2.38,2.158)
  rect 0.3x1.15 smd: A5(-1.25,2.158) A6(-0.25,2.158) A7(0.25,2.158) A8(1.25,2.158) B5(1.75,2.158) B6(0.75,2.158) B7(-0.75,2.158) B8(-1.75,2.158)

## Nets
As in the schematic.

Pads without a net: *1 0; *2 0; *3 0; *4 0; *5 0; *6 0; *7 0; *8 0; CN1 3; CN2 4; IO11 2 3; KEY1 2 3; KEY2 2 3; KEY3 2 3; RES 2 3; SW1 3; U1 3 4 5 6 7 8 9 10 11 14 15 16 17 18 19 20 21 23 24 25 26 27 28 29 30 33; U2 6 7 12 19 21 22; U3 7; U4 8; U5 1 4; U6 1 3 4 14 15 18 28 29 32 33 38 39 40 41 45 46; USB1 12 13 14 15 A5 A6 A7 A8 B5 B6 B7 B8

## Via types
v1: diameter 0.61, hole 0.305, Top Layer to Bottom Layer, 119 vias

## Routing (per net, layer and track width the routed paths; a pad name or vN(x,y) marks a point on that pad's centre or on a via; arc(x,y) is an arc through that point)
3V3: length 60.4
  Top Layer w0.254: 22.45,21.45 22.48,21.42 v1(25.33,21.42) ; 15.21,30.45 16.18,29.48 16.83,29.48 ; 4.89,21.47 4.93,21.5 4.93,22.83 ; U2.13 38.54,26.54 ; 4.03,14.94 4.03,17.53 4.33,17.84 ; 4.45,17.75 4.84,18.14 4.84,20.42 ; C13.2 32.71,25.27 34.29,25.27 34.56,25.54 34.56,25.9 ; 24.25,30.23 24.25,28.46 23.93,28.15 ; 5.89,22.72 5.71,22.9 3.75,22.9 ; 25.37,21.41 26.21,21.41 ; 3.62,25.22 3.64,22.94 ; 4.91,20.45 4.89,21.56 ; 15.13,24.15 14.27,24.15 14.13,24.29
  Top Layer w0.381: 39.52,23.14 39.52,25.19 38.23,26.48
  Bottom Layer w0.254: 14.05,6.48 14.05,10.92 13.83,11.15 ; 14.8,32.03 14.8,30.92 15.21,30.51 ; C6.2 15.28,9.11 16.15,8.23 U3.9 ; 19.68,13.08 19.91,13.31 23.9,13.31 24.28,12.93 24.32,12.93 ; 13.9,11.1 15.21,11.1 15.32,11.2 16.84,12.73 19.42,12.73 19.67,12.98 ; 32.16,29.57 31.72,29.57 30.81,28.65 ; 27.39,12.61 24.41,12.61
  Bottom Layer w0.508: 48.07,27.72 48.07,26.01 48.23,25.85
  vias: v1(3.53,32.49) v1(3.73,22.97) v1(4.33,17.73) v1(4.91,21.34) v1(4.9,20.53) v1(14.13,24.33) v1(15.21,30.45) v1(18.15,12.67) v1(24.25,29.1) v1(31.39,29.17) v1(32.91,25.28) v1(38.16,26.53) v1(41.54,14.45) v1(47.53,34.18) v1(48.21,25.67) v1(62.6,36.98) v1(66.95,17.54)
9V: length 47.9
  Inner1 w1.27: 59.22,27.84 59.32,27.94 59.32,30.34 ; v1(36.5,18.14) 36.5,22.17 42.03,27.7 59.36,27.7
  Bottom Layer w0.254: 58.16,23.5 58.26,23.39 D2.1
  Bottom Layer w0.508: 36.49,18.03 36.49,20.98 v1(36.52,20.98) 36.52,21.87 v1(36.5,21.88) 36.51,21.89 36.53,21.89
  Bottom Layer w0.762: 61.89,26.03 60.09,27.84 59.32,27.84 ; 59.32,27.84 59.27,27.89 59.27,30.3 ; 61.99,25.63 61.99,23.11 61.91,23.04
  vias: v1(36.51,20.33) v1(36.47,19.08) v1(36.96,22.99) v1(59.31,30.28) v1(59.3,29.48) v1(59.3,28.6) v1(59.31,27.83)
GND: length 10.4
  Bottom Layer w0.254: 13.83,12.57 13.83,12.64 13.36,13.11 ; 21.69,12.52 23.1,12.52 ; 15.21,12.62 13.92,12.62 13.86,12.57 ; 31.78,12.56 31.7,12.63 28.87,12.63
  Bottom Layer w0.457: 35.8,12.66 35.8,12 v1(35.75,11.95) 35.48,11.68 v1(35.48,11.39) ; 37.76,13.94 37.77,12.21 v1(38.18,11.54)
  vias: v1(3.45,29.55) v1(5.98,26.23) v1(13.34,13.06) v1(22.33,12.47) v1(31.04,12.57) v1(35.66,27.21) v1(36,16.75) v1(36.19,27.8) v1(37.83,21.64) v1(39.01,6.25) v1(39.94,29.43) v1(39.92,28.11) v1(41.94,17.31) v1(42.8,17.36) v1(45.47,6.31) v1(50.32,25.71) v1(50.42,29.43) v1(54.75,6.39) v1(54.8,5.63) v1(55.62,6.39) v1(55.62,5.63) v1(56.38,6.39) v1(56.41,5.6) v1(58.21,35.83) v1(58.19,35.12) v1(59.19,35.81) v1(59.21,35.06) v1(66.7,21.55) v1(68.19,21.53)
AIN1: length 21.3
  Top Layer w0.254: v1(18.67,15.88) 13.46,21.08 13.46,22.99 14.12,23.65 U6.10
  Bottom Layer w0.254: R19.1 18.8,15.75 v1(18.67,15.88)
AIN2: length 18.6
  Top Layer w0.254: v1(18.67,17.4) 18.54,17.4 14.1,21.84 14.1,22.73 14.51,23.15 U6.11
  Bottom Layer w0.254: R20.1 v1(18.67,17.4)
AOUT1: length 39
  Inner2 w1.016: v1(39.27,11.46) 39.27,14.19 40.57,15.48 46.03,15.48 50.41,11.1 60.44,11.1 61.48,12.14 64.63,12.14 65.25,11.51 66.68,11.51
  Bottom Layer w0.381: 40.06,15.37 39.78,15.09 39.04,15.09 38.46,14.51 38.46,13.47 ; 38.42,13.41 38.42,12.31 39.27,11.46
  Bottom Layer w0.457: v1(39.27,11.46) 39.27,11.55 v1(38.93,11.89)
  vias: v1(39.66,14.97) v1(40.11,15.35) v1(64.8,11.45) v1(65.66,11.48) v1(66.58,11.46)
AOUT2: length 38.4
  Inner2 w0.762: 38.32,15.47 37.14,14.28 v1(37.14,11.71)
  Inner2 w1.016: v1(37.85,14.95) 41.9,18.99 65.79,18.99
  Bottom Layer w0.381: 38.29,15.32 37.13,14.22 37.13,13.16 ; 37.15,11.58 37.15,11.7 v1(37.14,11.71) 37.08,11.76 37.08,13.38
  vias: v1(38.3,15.37) v1(64.17,18.98) v1(65.01,18.98) v1(65.81,18.96)
BAT+: length 30.6
  Top Layer w1.524: BAT.2 59.39,11.48 59.44,11.43 55.88,7.87 39.62,7.87 SW1.1
  Bottom Layer w1.27: U7.5 59.39,9.87 BAT.2
BIN1: length 14.2
  Top Layer w0.254: v1(16,21.21) 15.44,21.78 15.44,22.65
  Bottom Layer w0.254: R21.1 16.38,20.83 v1(16,21.21)
BIN2: length 12.9
  Top Layer w0.254: v1(18.67,18.92) 18.39,18.92 16.93,20.38 16.93,21.15
  Bottom Layer w0.254: v1(18.67,18.92) 28.28,18.92 R22.1
BLE_1: length 1.8
  Top Layer w0.254: BLE.1 68.68,29.71 68.86,29.54
BOOT0: length 5.3
  Top Layer w0.254: v1(18.41,28.19) 18.94,28.71 18.94,29.25
  Bottom Layer w0.254: v1(18.41,28.19) 18.41,31.71 18.81,32.1
BOOT1: length 11.8
  Top Layer w0.254: 24.23,31.92 23.16,30.85 23.16,29.11 20.42,26.37 20.42,21.71
  vias: v1(24.23,31.88)
BOUT1: length 37.6
  Bottom Layer w0.508: 35.1,13.38 35.11,14.5 34.8,14.86 34.04,14.86 33.53,14.35 33.53,14.22 ; 35.1,13.05 35.08,12.26 34.94,12.04 33.81,12.04 33.56,12.28 33.56,14.16
  Bottom Layer w0.762: CN2.1 7.05,11.75 9.53,14.22 33.53,14.22
BOUT2: length 49.2
  Top Layer w0.381: v1(36.09,10.7) 36,10.7 v1(35.57,10.26)
  Top Layer w0.762: v1(36.45,14.93) 36.2,15.18 v1(35.79,15.18) ; 7.24,19.25 9.1,19.25 18.68,9.66 34.96,9.66 v1(35.57,10.26) ; 34.61,9.9 34.62,14.16 35.69,15.18
  Bottom Layer w0.457: 36.09,10.7 36.51,12.02 36.46,14.92 36.2,15.18 35.79,15.18
  Bottom Layer w0.508: v1(35.57,10.26) 36,10.7 v1(36.09,10.7)
  Bottom Layer w0.762: 5.06,19.23 8.7,19.23
  vias: v1(7.2,19.26) v1(7.91,19.26) v1(8.64,19.26)
BS1: length 5
  Bottom Layer w0.254: 16.73,11.1 16.89,10.93 16.89,9.14 17.55,8.48 17.55,6.48
BT: length 8.5
  Top Layer w0.254: 19.93,21.15 19.93,22.36 19.81,22.48 v1(19.81,22.61)
  Bottom Layer w0.254: v1(19.81,22.61) 19.94,22.73 19.94,22.48 20.4,22.94 22.94,22.94 23,23 24.62,23 24.64,22.98 R7.1
C1N: length 6.7
  Bottom Layer w0.254: 12.06,12.64 12.83,11.88 12.83,9.53 13.35,9 U3.5
C1P: length 5
  Bottom Layer w0.254: 12.06,11.24 12.06,9.4 12.65,8.81 12.65,6.48
C2N: length 6.7
  Bottom Layer w0.254: 10.54,12.64 11.3,11.88 11.3,9.27 11.95,8.62 U3.3
C2P: length 5.1
  Bottom Layer w0.254: 11.25,6.48 11.25,8.31 10.54,9.02 10.54,11.24
CT1: length 65.7
  Top Layer w0.254: U6.16 18.44,22.37 v1(18.47,22.41)
  Inner2 w0.254: 18.46,22.5 33.34,7.62 50.35,7.62 53.26,4.7 63.08,4.7 68.11,9.73 68.11,13.47 66.98,14.61
  vias: v1(67.07,14.52)
CT2: length 17.7
  Top Layer w0.254: U6.17 18.94,20.08 v1(18.8,19.94)
  Bottom Layer w0.254: CN2.3 5.98,14.74 11.18,19.94 v1(18.8,19.94)
D/C: length 7.2
  Bottom Layer w0.254: 24.49,11.1 23.04,11.1 20.35,8.41 U3.15
HC05_RX: length 21.1
  Top Layer w0.254: 24.48,25.14 25.01,25.14 31.62,31.75 39.1,31.75 41.54,34.19 41.81,34.19
HC05_TX: length 22.5
  Top Layer w0.254: 24.59,25.66 24.77,25.66 31.5,32.39 37.83,32.39 38.74,33.29 38.74,34.98 39.51,35.75 41.91,35.75
IN+: length 33.6
  Bottom Layer w0.254: U7.8 56.78,3.45 56.78,3.05 55.24,3.07 53.59,4.71 53.59,8.25 53.21,8.64
  Bottom Layer w0.508: 44.67,6.22 44.67,7.84 44.7,7.87 39.91,7.87 39.91,6.22 ; 34.42,7.89 40.39,7.87
  Bottom Layer w1.016: 52.58,9.27 52.13,9.72 49.85,9.72 48.01,7.87 44.7,7.87
OSCIN: length 8
  Top Layer w0.254: 7.76,27.18 11.43,27.18 11.59,27.34 11.59,27.84 ; 15.44,26.15 11.79,26.15
OSCOUT: length 8.7
  Top Layer w0.254: 11.88,23.27 14.27,25.66 15.21,25.66 ; 7.72,25.05 9.62,25.05 11.36,23.31
PB12: length 22.4
  Top Layer w0.254: 24.1,22.64 28.55,22.64 28.76,22.43
  Top Layer w0.381: 37.64,34.56 37.61,34.6 37.61,35.42
  Inner1 w0.254: 37.7,35.52 37.7,31.33 v1(28.78,22.4)
  vias: v1(37.64,35.42)
PB13: length 19.7
  Top Layer w0.254: 28.73,23.47 28.45,23.2 24.2,23.2
  Top Layer w0.381: 33.94,35.47 33.96,34.62
  Inner1 w0.254: 33.94,35.42 33.94,28.66 v1(28.71,23.43)
  vias: v1(33.95,35.43)
PB14: length 18.2
  Top Layer w0.254: 23.92,23.67 27.89,23.67 28.67,24.44
  Top Layer w0.381: 30.4,33.86 30.28,33.98 v1(30.28,35.42)
  Inner1 w0.254: v1(28.72,24.47) 30.27,26.01 30.27,35.34
PC13: length 13.8
  Top Layer w0.254: R10.2 4.48,28.32 8.76,28.32 9.91,29.46 12.7,29.46 14.51,27.65 U6.2
POWER: length 138.4
  Top Layer w0.762: 6.32,13.88 4.33,11.88 3.49,11.88 ; 6.18,14.81 6.2,14.78 8.5,14.78
  Top Layer w1.524: 63.59,26.78 56.9,20.08 56.9,11.81 55.37,10.29 51.18,10.29 50.02,11.44 C4.2 40,13.08 C15.1 ; SW1.2 42.16,12.45 42.04,12.45
  Inner1 w0.254: 26.28,24.49 17.35,24.49 8.47,15.61 8.47,14.85
  Inner1 w0.762: 7.22,14.8 8.72,14.8 19.77,3.75 40.52,3.75 42.2,5.42 42.2,10.21
  Bottom Layer w0.508: 45.72,26.03 45.72,27.55 ; 50.91,19.54 45.83,24.63 45.83,25.9
  Bottom Layer w1.524: SW1.2 42.16,10.29 51.18,19.3 53.18,19.3
  vias: v1(7.23,14.77) v1(7.86,14.78) v1(8.5,14.78) v1(26.23,24.48)
R10_1: length 2.2
  Top Layer w0.254: PC.2 1.74,25.45 R10.1
R11_1: length 2.1
  Top Layer w0.254: 1.46,32.51 1.8,32.17 R11.1
R12_2: length 5.3
  Bottom Layer w0.254: 22.92,32.14 22.92,35.57 21.62,36.87
R13_1: length 2.1
  Bottom Layer w0.254: 20.83,32.6 21.77,33.54 21.77,34.33
R23_1: length 2
  Bottom Layer w0.254: U7.2 51.28,6.35 R23.1
R26_2: length 1.9
  Bottom Layer w0.254: 53.46,1.26 53.46,2.8 53.73,3.07
R28_2: length 1.8
  Bottom Layer w0.254: 58.32,1.22 58.29,1.25 58.29,3.05
RES: length 7.9
  Bottom Layer w0.254: 18.18,11.1 19.68,9.6 D1.1 ; D1.1 20.26,10.02 21.45,11.21 21.62,11.21 ; D1.1 19.65,9.44 19.65,6.48
RESET: length 20.9
  Top Layer w0.254: 17.18,26.16 16.16,25.15 15.38,25.15 ; 26.61,34.19 24.98,32.55 16.27,32.55 v1(16.27,32.41)
  Inner1 w0.254: 16.3,32.39 17.18,31.51 17.18,26.22
  Bottom Layer w0.254: 16.29,32.45 16.29,33.37
  vias: v1(17.14,26.23)
SCL_MPU: length 17.4
  Top Layer w0.254: v1(20.07,30.99) 19.93,30.86 19.93,29.65 ; v1(34.54,31.11) 34.56,31.1 34.56,29.73
  Bottom Layer w0.254: v1(20.07,30.99) 20.07,31.11 v1(34.54,31.11)
SCL_OLED: length 18.7
  Top Layer w0.254: v1(25.91,11.05) 25.91,13.21 20.93,18.18 20.93,21.15
  Bottom Layer w0.254: 25.94,11.1 24.5,9.65 23.75,9.65 22.48,8.38 22.48,6.5 U3.18
SDA_MPU: length 16.9
  Top Layer w0.254: v1(33.27,30.35) 33.91,30.35 34.06,30.21 34.06,29.73 ; U6.43 19.44,30.6 v1(19.18,30.86)
  Bottom Layer w0.254: v1(33.27,30.35) 19.69,30.35 v1(19.18,30.86)
SDA_OLED: length 21.6
  Top Layer w0.254: v1(27.43,11.05) 27.43,12.57 21.44,18.57 U6.22
  Bottom Layer w0.254: 23.85,6.48 23.85,8.34 ; 23.15,6.48 23.11,6.52 23.11,8.13 23.5,8.51 24.81,8.51 27.39,11.1
SWCLK: length 16
  Top Layer w0.254: 22.46,30.1 22.42,30.15 22.42,30.46 21.15,31.73 12.44,31.73 8.8,35.39
SWDIO: length 17.1
  Top Layer w0.254: 23.44,27.15 22.65,27.15
  Bottom Layer w0.254: 22.62,27.16 17.36,27.16 11.13,33.39 11.13,35.6
  vias: v1(22.63,27.15)
U1_12: length 3.1
  Top Layer w0.381: 41.77,19.36 41.29,19.36 39.44,21.22
U1_31: length 16.4
  Bottom Layer w0.254: v1(54.96,31.28) 58.1,34.42 63.75,34.42 67.26,30.91 67.26,29.54
  vias: v1(67.26,29.54)
U1_32: length 13.6
  Top Layer w0.254: STATE.2 67.18,33.15 65.02,33.15 64.13,34.04 61.72,34.04 59.94,32.26 58.42,32.26 57.9,32.78 U1.32
U1_34: length 6.6
  Top Layer w0.254: 57.98,39.17 56.54,39.17 R9.2 55.03,38.9 54.48,38.35 54.48,36.26 U1.34
U2_9: length 1.9
  Top Layer w0.254: R8.1 35.06,24.4 35.06,25.9
U2_10: length 2.1
  Top Layer w0.254: 36.64,24.26 35.56,25.34 35.56,25.9
U2_20: length 3
  Top Layer w0.254: 36.06,29.73 36.06,30.21 36.19,30.35 38.54,30.35
U3_26: length 4.9
  Bottom Layer w0.254: 28.85,11.1 28.05,10.3 28.05,6.48
U3_27: length 5.3
  Bottom Layer w0.254: U3.27 28.75,9.6 30.3,11.15
U3_28: length 5.6
  Bottom Layer w0.254: 29.45,6.48 29.45,8.85 C29.2
U4_1: length 2.5
  Bottom Layer w0.254: 41.35,12.75 39.73,12.75 39.09,13.38
U4_9: length 5.8
  Bottom Layer w0.254: R21.2 33.78,20.83 34.51,20.1 34.51,19.12
U4_10: length 6.7
  Bottom Layer w0.254: 35.16,19.12 35.16,18.15 34.93,17.91 34.04,17.91 32.89,19.05 R22.2
U4_11: length 3.1
  Bottom Layer w0.508: 35.8,19.73 35.8,20.24 34.37,21.67 34.37,22.27
U4_14: length 4.6
  Bottom Layer w0.254: 37.77,19.05 37.77,20.13 38.89,21.25 40.83,21.25
U4_15: length 9.7
  Bottom Layer w0.254: 38.41,19.12 38.41,18.23 38.42,18.15 37.72,17.4 R20.2
U4_16: length 11.3
  Bottom Layer w0.254: R19.2 30.01,16.09 37.17,16.09 39.06,17.99 39.06,19.12
U5_3: length 6.5
  Bottom Layer w0.254: 53.18,20.57 54.48,20.57 54.99,21.08 54.99,23.5 55.12,23.5 ; 54.73,23.62 56.52,23.62 R24.1
U5_5: length 15.5
  Bottom Layer w1.016: 62.33,16.76 62.28,16.81 61.1,16.81 ; 61.62,18.73 61.62,16.32 61.75,16.19 ; 62.41,17.98 62.56,17.84 62.56,16.1 ; 61.16,16.09 61.16,19.12 61.11,19.18 ; 61.14,16.18 62.47,16.18 62.52,16.13 ; 58.68,20.71 59.86,20.71 61.93,18.64 ; 58.57,21.78 58.55,20.71
  vias: v1(61.14,16.79) v1(61.17,16.13) v1(61.81,16.78) v1(61.88,16.1) v1(62.46,16.78) v1(62.51,16.09)
U7_6: length 7.5
  Top Layer w0.254: v1(58.41,7.62) 58.41,4.01 v1(55.66,1.26)
U7_7: length 6.5
  Bottom Layer w0.254: U7.7 59.31,6.35 60.45,5.21 60.45,1.28 60.52,1.22

## Copper pours and planes (outline as drawn; the poured copper is in the pictures)
3V3 on Inner1: -1.45,42.39 -1.16,42.11 73.63,42.11 74,41.73 74,-1.26 73.91,-1.17 -1.92,-1.17
GND on Top Layer: -1.54,41.35 -1.45,41.26 72.59,41.26 72.87,40.98 71.93,20.14 72.87,-0.32 72.03,-1.17 -1.35,-1.17
GND on Bottom Layer: -3.8,42.86 -3.42,42.48 73.06,42.48 74.28,41.26 74.28,-1.83 73.34,-2.77 -3.99,-2.77 -3.7,-2.49
GND on Inner2: -2.67,43.52 -1.63,42.48 75.04,42.48 74.57,42.01 74.57,-0.79 73.91,-1.45 -4.17,-1.45

Small or netless copper shapes (teardrops, artwork), in the pictures only: 116 on Top Layer, 157 on Bottom Layer, 11 on Inner1, 8 on Inner2

## Text on the board
Top Silkscreen Layer: - | + | CLK | DIO | GND | 3V3 | 3v3   GND | 1/2
